# EAGLE design ATMega48 Breakout (EAGLE 6.5.0)
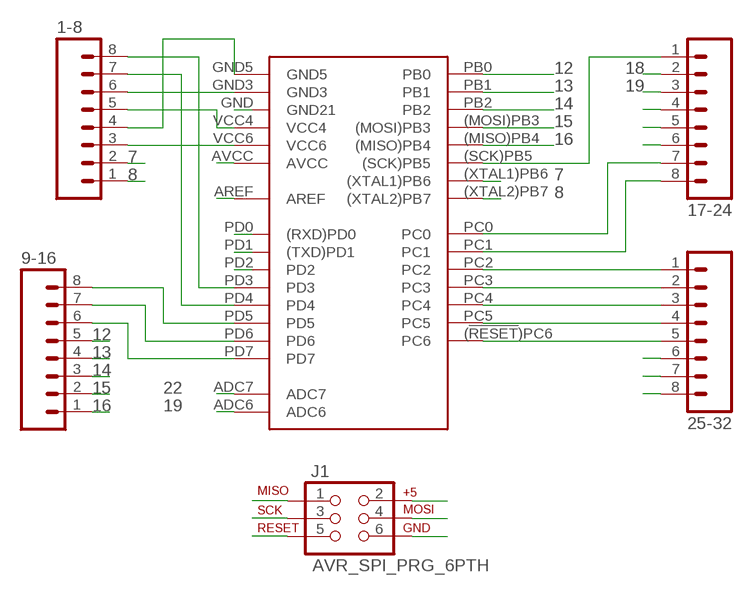
[diagram p0: schematic, sheet 1]

## Parts
1-8  M081X08  [1X08]
9-16  M081X08  [1X08]
17-24  M081X08  [1X08]
25-32  M081X08  [1X08]
J1  AVR_SPI_PRG_6PTH  [2X3]
MAIN  ATMEGA48  [TQFP-32]

## Nets
3: 1-8.6 J1.6 MAIN.GND3
4: 1-8.5 J1.2 MAIN.VCC4
7: 1-8.2 MAIN.(XTAL1)PB6
8: 1-8.1 MAIN.(XTAL2)PB7
12: 9-16.5 MAIN.PB0
13: 9-16.4 MAIN.PB1
14: 9-16.3 MAIN.PB2
15: 9-16.2 J1.4 MAIN.(MOSI)PB3
16: 9-16.1 J1.1 MAIN.(MISO)PB4
17: 17-24.1 J1.3 MAIN.(SCK)PB5
18: 17-24.2 MAIN.AVCC
19: 17-24.3 MAIN.ADC6
20: 17-24.4 MAIN.AREF
21: 17-24.5 MAIN.GND(GND21)
22: 17-24.6 MAIN.ADC7
29: 25-32.5 J1.5 MAIN.(!RESET!)PC6(PC6)
30: 25-32.6 MAIN.PD0((RXD)PD0)
31: 25-32.7 MAIN.PD1((TXD)PD1)
32: 25-32.8 MAIN.PD2
N$1: 1-8.8 MAIN.PD3
N$2: 1-8.7 MAIN.PD4
N$5: 1-8.4 MAIN.GND5
N$6: 1-8.3 MAIN.VCC6
N$7: 9-16.8 MAIN.PD5
N$8: 9-16.7 MAIN.PD6
N$9: 9-16.6 MAIN.PD7
N$10: 17-24.7 MAIN.PC0
N$11: 17-24.8 MAIN.PC1
N$12: 25-32.1 MAIN.PC2
N$13: 25-32.2 MAIN.PC3
N$14: 25-32.3 MAIN.PC4
N$15: 25-32.4 MAIN.PC5

## Library data of the parts
1-8 9-16 17-24 25-32 = SparkFun-Connectors:M08: Header 8 Standard 8-pin 0.1" header. Use with straight break away headers (SKU : PRT-00116), right angle break away headers (PRT-00553), swiss pins (PRT-00743), machine pins (PRT-00117), and female headers (PRT-00115).
J1 = SparkFun-Connectors:AVR_SPI_PRG_6: AVR ISP 6 Pin This is the reduced ISP connector for AVR programming. Common on Arduino. This footprint will take up less PCB space and can be used with a 10-pin to 6-pin adapter such as SKU: BOB-08508
MAIN = NU STEM:ATMEGA48

## Board
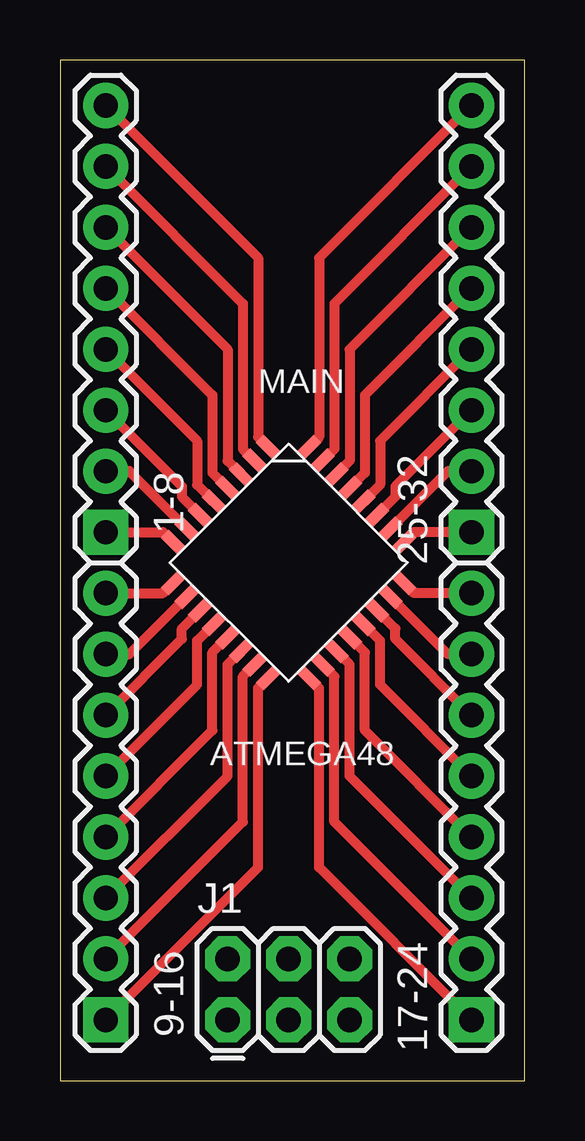
[diagram p1: board, top side]
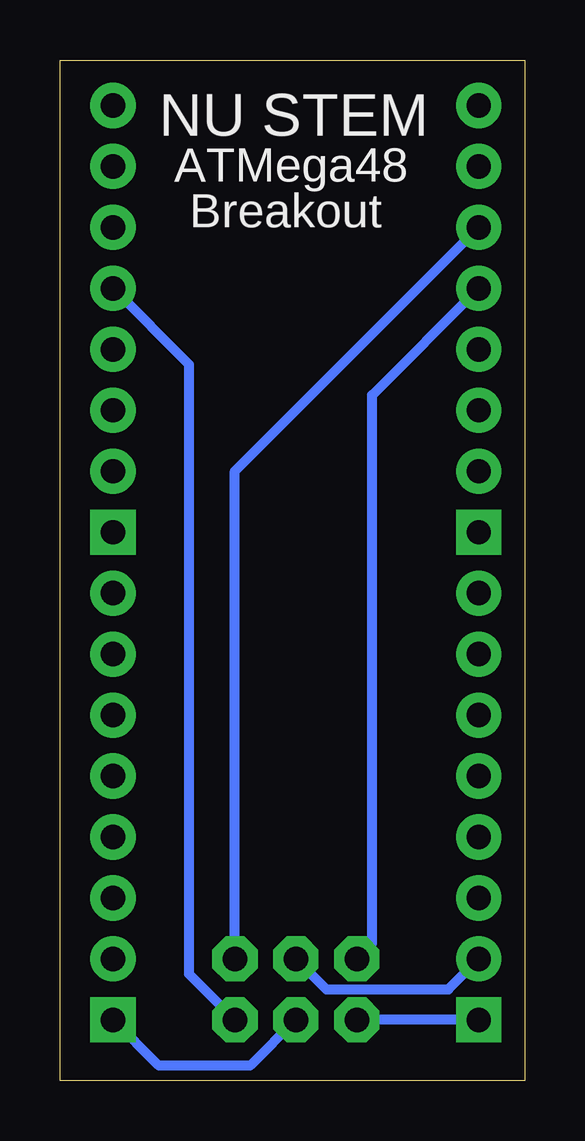
[diagram p2: board, bottom side, seen from below]

Size 19.36 x 42.54 mm. Coordinates in mm from the lower left corner, seen from the top.
Outline: 0,0 19.36,0 19.36,42.54 0,42.54 0,0
Copper layers (1*16): Top 0.035mm / dielectric 1.5mm / Bottom 0.035mm
Design rules "default": minimum track width 10mil, minimum drill 24mil, track to track 8mil, track to pad 8mil, pad to pad 8mil, via to via 8mil, smd to smd 8mil, copper to edge 40mil, drill to drill 8mil, minimum pad ring 10mil, minimum via ring 8mil, stop-mask expansion 4mil, vias tented up to drill 0mil, thermal gap 10mil

### Footprints (pad centres in the part's own frame; a part is rotated, then mirrored left to right if it is on the bottom)
1X08 = drill 1.016 pad 1.88 square: 1 0,0 | drill 1.016 pad 1.88: 2 2.54,0; 3 5.08,0; 4 7.62,0; 5 10.16,0; 6 12.7,0; 7 15.24,0; 8 17.78,0
2X3 = drill 1.016 pad 1.88 octagon: 1 0,0; 2 0,2.54; 3 2.54,0; 4 2.54,2.54; 5 5.08,0; 6 5.08,2.54
TQFP-32 = smd 0.46 x 1: (!RESET!)PC6 -0.4,4; (MISO)PB4 2.8,-4; (MOSI)PB3 2,-4; PB0 -0.4,-4; PB1 0.4,-4; PB2 1.2,-4; PC2 2.8,4; PC3 2,4; PC4 1.2,4; PC5 0.4,4; PD0 -1.2,4; PD1 -2,4; PD2 -2.8,4; PD5 -2.8,-4; PD6 -2,-4; PD7 -1.2,-4 | smd 1 x 0.46: (SCK)PB5 4,-2.8; (XTAL1)PB6 -4,-2; (XTAL2)PB7 -4,-2.8; ADC6 4,-1.2; ADC7 4,1.2; AREF 4,-0.4; AVCC 4,-2; GND 4,0.4; GND3 -4,1.2; GND5 -4,-0.4; PC0 4,2; PC1 4,2.8; PD3 -4,2.8; PD4 -4,2; VCC4 -4,0.4; VCC6 -4,-1.2

### Placement (x,y rotation side)
1-8  1.91,22.86 90 top
9-16  1.91,2.54 90 top
17-24  17.14,2.54 90 top
25-32  17.14,22.86 90 top
J1  6.99,2.54 0 top
MAIN  9.52,21.59 315 top

### Tracks (layer width: path | path; a pad name or v marks a point on that pad's centre or on a via)
3
  Top 0.406: 1-8.6 6.99,30.48 6.99,25.83 MAIN.GND3
  Bottom 0.406: J1.6 12.07,25.4 1-8.6
4
  Top 0.406: 1-8.5 6.35,28.57 6.35,25.33 MAIN.VCC4
  Bottom 0.406: J1.2 6.35,5.72 6.35,28.57 1-8.5
7
  Top 0.406: 1-8.2 2.89,25.4 MAIN.(XTAL1)PB6
8
  Top 0.406: 1-8.1 4.29,22.86 MAIN.(XTAL2)PB7
12
  Top 0.406: 9-16.5 5.72,16.51 5.72,18.35 MAIN.PB0
13
  Top 0.406: 9-16.4 6.35,14.61 6.35,17.85 MAIN.PB1
14
  Top 0.406: 9-16.3 6.99,12.7 6.99,17.35 MAIN.PB2
15
  Top 0.406: 9-16.2 7.62,10.8 7.62,16.86 MAIN.(MOSI)PB3
  Bottom 0.406: J1.4 8.25,3.81 3.17,3.81 9-16.2
16
  Top 0.406: 9-16.1 8.25,8.89 8.25,16.36 MAIN.(MISO)PB4
  Bottom 0.406: 9-16.1 J1.1
17
  Top 0.406: 17-24.1 10.8,8.89 10.8,16.36 MAIN.(SCK)PB5
  Bottom 0.406: J1.3 11.43,0.63 15.24,0.63 17-24.1
18
  Top 0.406: 17-24.2 11.43,10.8 11.43,16.86 MAIN.AVCC
19
  Top 0.406: 17-24.3 12.07,12.7 12.07,17.35 MAIN.ADC6
20
  Top 0.406: 17-24.4 12.7,14.61 12.7,17.85 MAIN.AREF
21
  Top 0.406: 17-24.5 13.34,16.51 13.34,18.35 MAIN.GND
22
  Top 0.406: 17-24.6 13.97,18.41 13.97,18.84 MAIN.ADC7
29
  Top 0.406: 25-32.5 12.7,28.57 12.7,25.33 MAIN.(!RESET!)PC6
  Bottom 0.406: J1.5 13.97,4.45 13.97,29.84 25-32.5
30
  Top 0.406: 25-32.6 12.07,30.48 12.07,25.83 MAIN.PD0
31
  Top 0.406: 25-32.7 11.43,32.38 11.43,26.32 MAIN.PD1
32
  Top 0.406: 25-32.8 10.8,34.29 10.8,26.82 MAIN.PD2
N$1
  Top 0.406: 1-8.8 8.25,34.29 8.25,26.82 MAIN.PD3
N$2
  Top 0.406: 1-8.7 7.62,32.38 7.62,26.32 MAIN.PD4
N$5
  Top 0.406: 1-8.4 5.72,26.67 5.72,24.83 MAIN.GND5
N$6
  Top 0.406: 1-8.3 5.08,24.77 5.08,24.34 MAIN.VCC6
N$7
  Top 0.406: 9-16.8 4.29,20.32 MAIN.PD5
N$8
  Top 0.406: 9-16.7 2.89,17.78 MAIN.PD6
N$9
  Top 0.406: 9-16.6 5.08,18.41 5.08,18.84 MAIN.PD7
N$10
  Top 0.406: 17-24.7 16.16,17.78 MAIN.PC0
N$11
  Top 0.406: 17-24.8 14.75,20.32 MAIN.PC1
N$12
  Top 0.406: 25-32.1 14.75,22.86 MAIN.PC2
N$13
  Top 0.406: 25-32.2 16.16,25.4 MAIN.PC3
N$14
  Top 0.406: 25-32.3 13.97,24.77 13.97,24.34 MAIN.PC4
N$15
  Top 0.406: 25-32.4 13.34,26.67 13.34,24.83 MAIN.PC5

### Text on the board
_bsilk: NU STEM | ATMega48 | Breakout